# Altium project efuse.PrjPcb
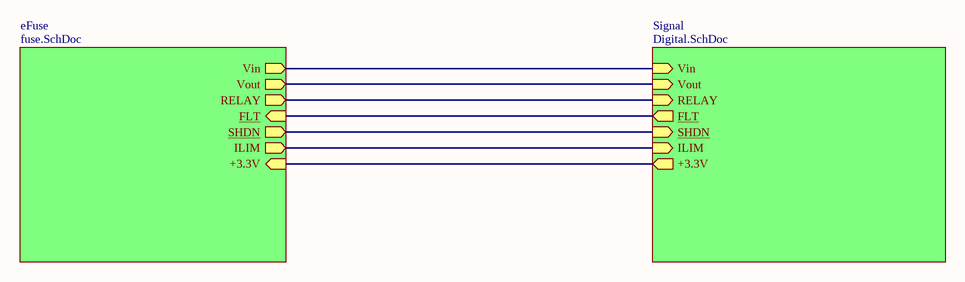
[diagram p0: top.SchDoc]
3 sheets, 45 parts. Net scope: hierarchical (ports join the sheet entries above them; power ports are global).
Board files: eFuse_proto1.PcbDoc, efuseV0.2.PcbDoc
Sheets:
  top.SchDoc
    eFuse = fuse.SchDoc
    Signal = Digital.SchDoc

## Sheet top.SchDoc
size A4; SheetNumber: 1; SheetTotal: 5

### Sub-sheets
eFuse = fuse.SchDoc: Vin (out), RELAY (out), FLT (in), SHDN (out), ILIM (out), Vout (out), +3.3V (in)
Signal = Digital.SchDoc: Vin (in), RELAY (in), FLT (out), SHDN (in), ILIM (in), Vout (in), +3.3V (out)

### Nets
+3.3V: sheet eFuse/+3.3V, sheet Signal/+3.3V
Vin: sheet eFuse/Vin, sheet Signal/Vin
Vout: sheet eFuse/Vout, sheet Signal/Vout
NetD3_2: sheet eFuse/RELAY, sheet Signal/RELAY
NetD5_1: sheet eFuse/FLT, sheet Signal/FLT
NetU1_4: sheet eFuse/SHDN, sheet Signal/SHDN
NetU7_11: sheet eFuse/ILIM, sheet Signal/ILIM

## Sheet fuse.SchDoc
size A4; SheetNumber: 2; SheetTotal: 3
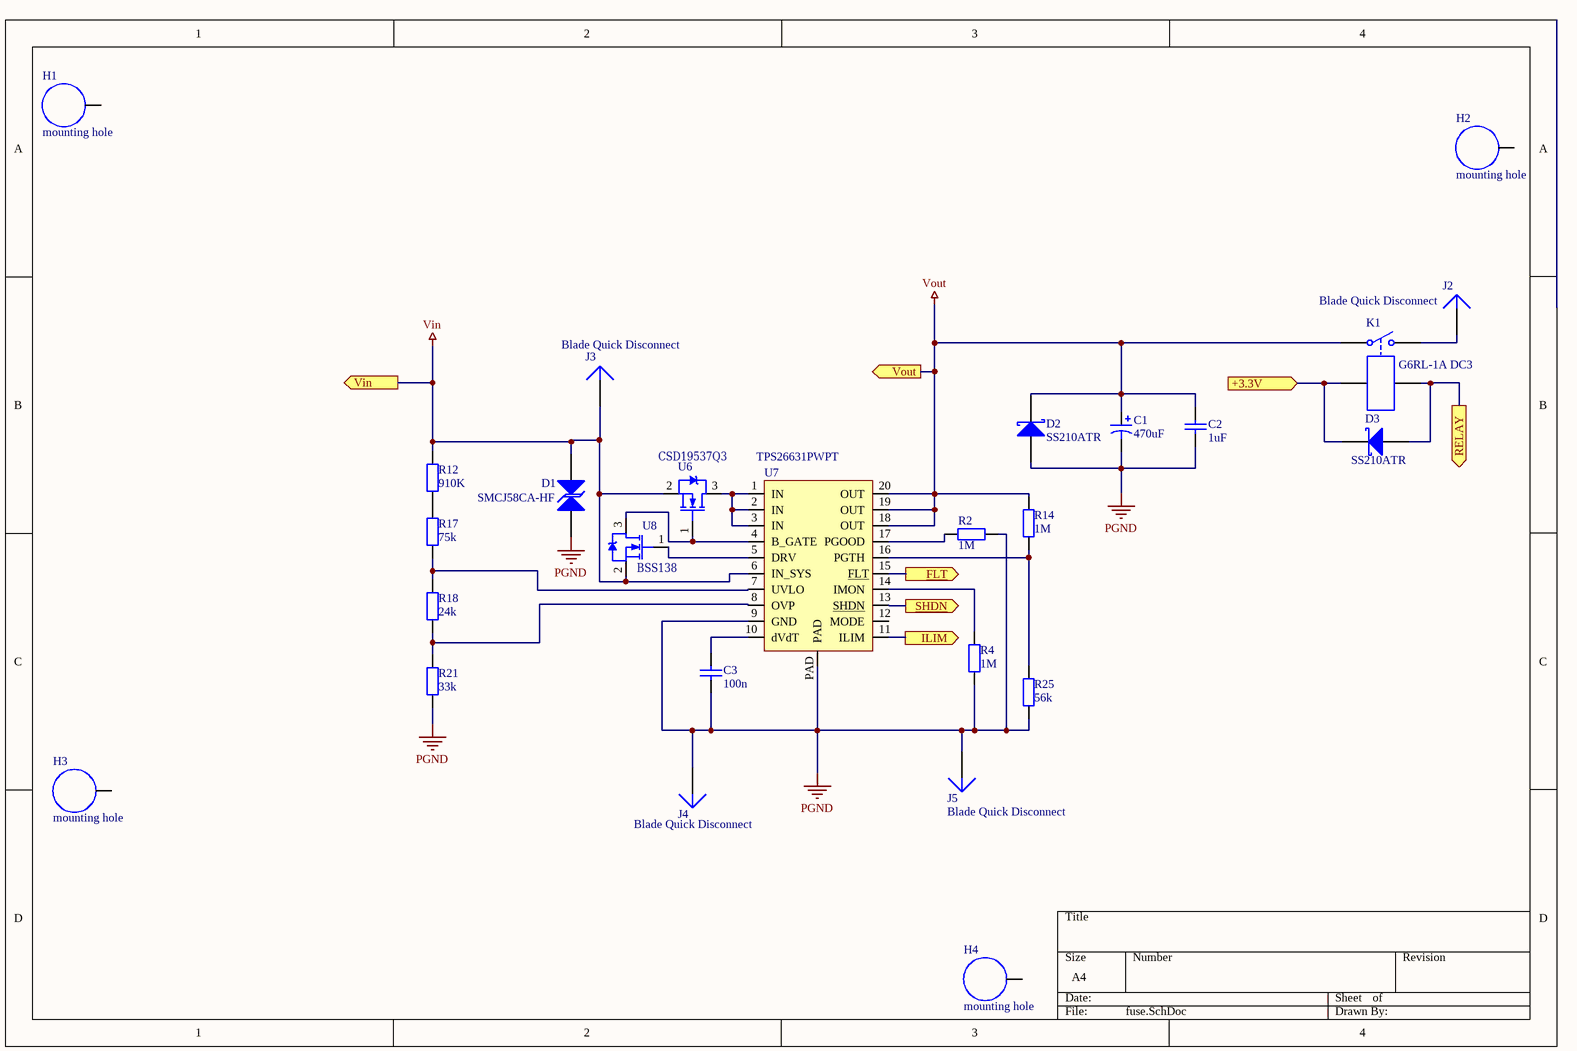
[diagram p1: fuse.SchDoc]

### Parts
C1  470uF  [CAP_16MM_SMD]
C2  1uF  [0805]
C3  100n  [0805]
D1  SMCJ58CA-HF  [DO-214AB-SMC Bipolar]
D2  SS210ATR  [DO-214AC, SMA]
D3  SS210ATR  [DO-214AC, SMA]
H1  mounting hole  [M3 HOLE iso]
H2  mounting hole  [M3 HOLE iso]
H3  mounting hole  [M3 HOLE iso]
H4  mounting hole  [M3 HOLE iso]
J2  Blade Quick Disconnect  [TE blade connector]
J3  Blade Quick Disconnect  [TE blade connector]
J4  Blade Quick Disconnect  [TE blade connector]
J5  Blade Quick Disconnect  [TE blade connector]
K1  G6RL-1A DC3  [G6RL-1A DC3 relay]
R2  1M  [0805]
R4  1M  [0805]
R12  910K  [0805]
R14  1M  [0805]
R17  75k  [0805]
R18  24k  [0805]
R21  33k  [0805]
R25  56k  [0805]
U6  ‎CSD19537Q3‎  [8-VSON (3,3x3,3)]
U7  TPS26631PWPT  [TSSOP_P065S6.6x6.6]
U8  BSS138‎  [SOT-23-3]

### Ports
+3.3V (in), FLT (out), ILIM (out), RELAY (out), SHDN (out), Vin (out), Vout (out)

### Nets
+3.3V: D3.1(K) K1.1 ; port +3.3V
PGND: C1.2 C2.1 C3.2 D1.1(A) D2.2(A) J4.1 J5.1 R2.1 R4.2 R21.1 R25.1 U7.9(GND) U7.PAD
Vin: D1.2(K) J3.1 R12.2 U6.2(D) U7.6(IN_SYS) U8.2(D) ; port Vin
Vout: C1.1 C2.2 D2.1(K) K1.2 R14.2 U7.18(OUT) U7.19(OUT) U7.20(OUT) ; port Vout
NetC3_1: C3.1 U7.10(dVdT)
NetD3_2: D3.2(A) K1.5 ; port RELAY
NetD5_1: U7.15(FLT) ; port FLT
NetJ2_1: J2.1 K1.3
NetR2_2: R2.2 U7.17(PGOOD)
NetR4_1: R4.1 U7.14(IMON)
NetR12_1: R12.1 R17.2
NetR14_1: R14.1 R25.2 U7.16(PGTH)
NetR17_1: R17.1 R18.2 U7.7(UVLO)
NetR18_1: R18.1 R21.2 U7.8(OVP)
NetU1_4: U7.13(SHDN) ; port SHDN
NetU6_1: U6.1(G) U7.4(B_GATE) U8.3(S)
NetU6_3: U6.3(S) U7.1(IN) U7.2(IN) U7.3(IN)
NetU7_5: U7.5(DRV) U8.1(G)
NetU7_11: U7.11(ILIM) ; port ILIM

Not connected (* = marked no-connect by the designer): H1 1; H2 1; H3 1; H4 1; U7 12(MODE)

### Library data of the parts
C1 = cap pol
C2 C3 = cap
D1 = TVS Diode
D2 D3 = shotkey diode
K1 = Relay
R2 R4 R12 R14 R17 R18 R21 R25 = res0805
U6 U8 = N-mosfet en

## Sheet Digital.SchDoc
size A4; SheetNumber: 3; SheetTotal: 3
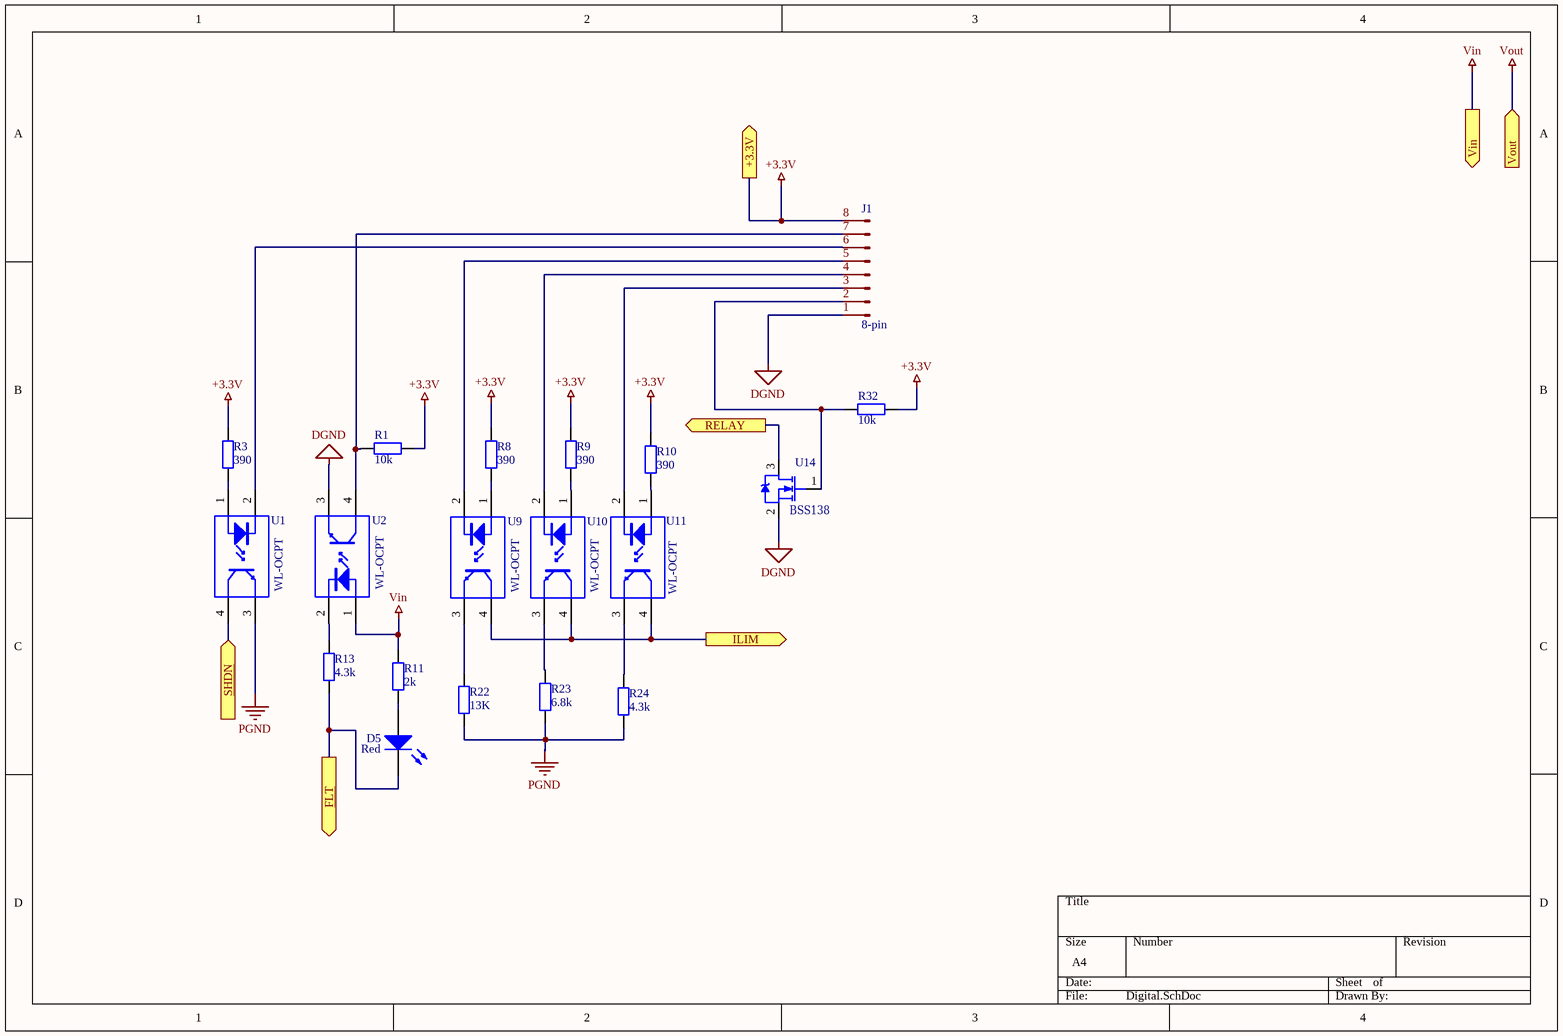
[diagram p2: Digital.SchDoc]

### Parts
D5  Red  [0805 LED]
J1  8-pin  [JST_XH_B8B-XH-A_1x08_P2.50mm_Vertical]
R1  10k  [0805]
R3  390  [0805]
R8  390  [0805]
R9  390  [0805]
R10  390  [0805]
R11  2k  [0805]
R13  4.3k  [0805]
R22  13K  [0805]
R23  6.8k  [0805]
R24  4.3k  [0805]
R32  10k  [0805]
U1  WL-OCPT  [4-SOP_WE_opto-isolator]
U2  WL-OCPT  [4-SOP_WE_opto-isolator]
U9  WL-OCPT  [4-SOP_WE_opto-isolator]
U10  WL-OCPT  [4-SOP_WE_opto-isolator]
U11  WL-OCPT  [4-SOP_WE_opto-isolator]
U14  BSS138‎  [SOT-23-3]

### Ports
+3.3V (out), FLT (out), ILIM (out), RELAY (out), SHDN (in), Vin (out), Vout (in)

### Nets
+3.3V: J1.8(Pin_8) R1.1 R3.2 R8.2 R9.2 R10.2 R32.2 ; port +3.3V
DGND: J1.1(Pin_1) U2.3(E) U14.2(D)
PGND: R22.1 R23.1 R24.1 U1.3(E)
Vin: R11.2 U2.1(A) ; port Vin
NetD3_2: U14.3(S) ; port RELAY
NetD5_1: D5.1(K) R13.1 ; port FLT
NetD5_2: D5.2(A) R11.1
NetJ1_2: J1.2(Pin_2) R32.1 U14.1(G)
NetJ1_3: J1.3(Pin_3) U11.2(C)
NetJ1_4: J1.4(Pin_4) U10.2(C)
NetJ1_5: J1.5(Pin_5) U9.2(C)
NetJ1_6: J1.6(Pin_6) U1.2(C)
NetJ1_7: J1.7(Pin_7) R1.2 U2.4(C)
NetR3_1: R3.1 U1.1(A)
NetR8_1: R8.1 U9.1(A)
NetR9_1: R9.1 U10.1(A)
NetR10_1: R10.1 U11.1(A)
NetR13_2: R13.2 U2.2(C)
NetR22_2: R22.2 U9.3(E)
NetR23_2: R23.2 U10.3(E)
NetR24_2: R24.2 U11.3(E)
NetU1_4: U1.4(C) ; port SHDN
NetU7_11: U9.4(C) U10.4(C) U11.4(C) ; port ILIM

### Library data of the parts
D5 = LED
R1 R3 R8-R11 R13 R22-R24 R32 = res0805
U1 U2 U9-U11 = optoc WE
U14 = N-mosfet en

## Nets that join several sheets
+3.3V: fuse (D3.1 K1.1), Digital (7 pins)
PGND: fuse (13 pins), Digital (R22.1 R23.1 R24.1 U1.3)
Vin: fuse (6 pins), Digital (R11.2 U2.1)
NetD3_2: fuse (D3.2 K1.5), Digital (U14.3)
NetD5_1: fuse (U7.15), Digital (D5.1 R13.1)
NetU1_4: fuse (U7.13), Digital (U1.4)
NetU7_11: fuse (U7.11), Digital (U9.4 U10.4 U11.4)